# Altium schematic sheet Folio01.SchDoc
size A3; SheetNumber: 1; SheetTotal: 1
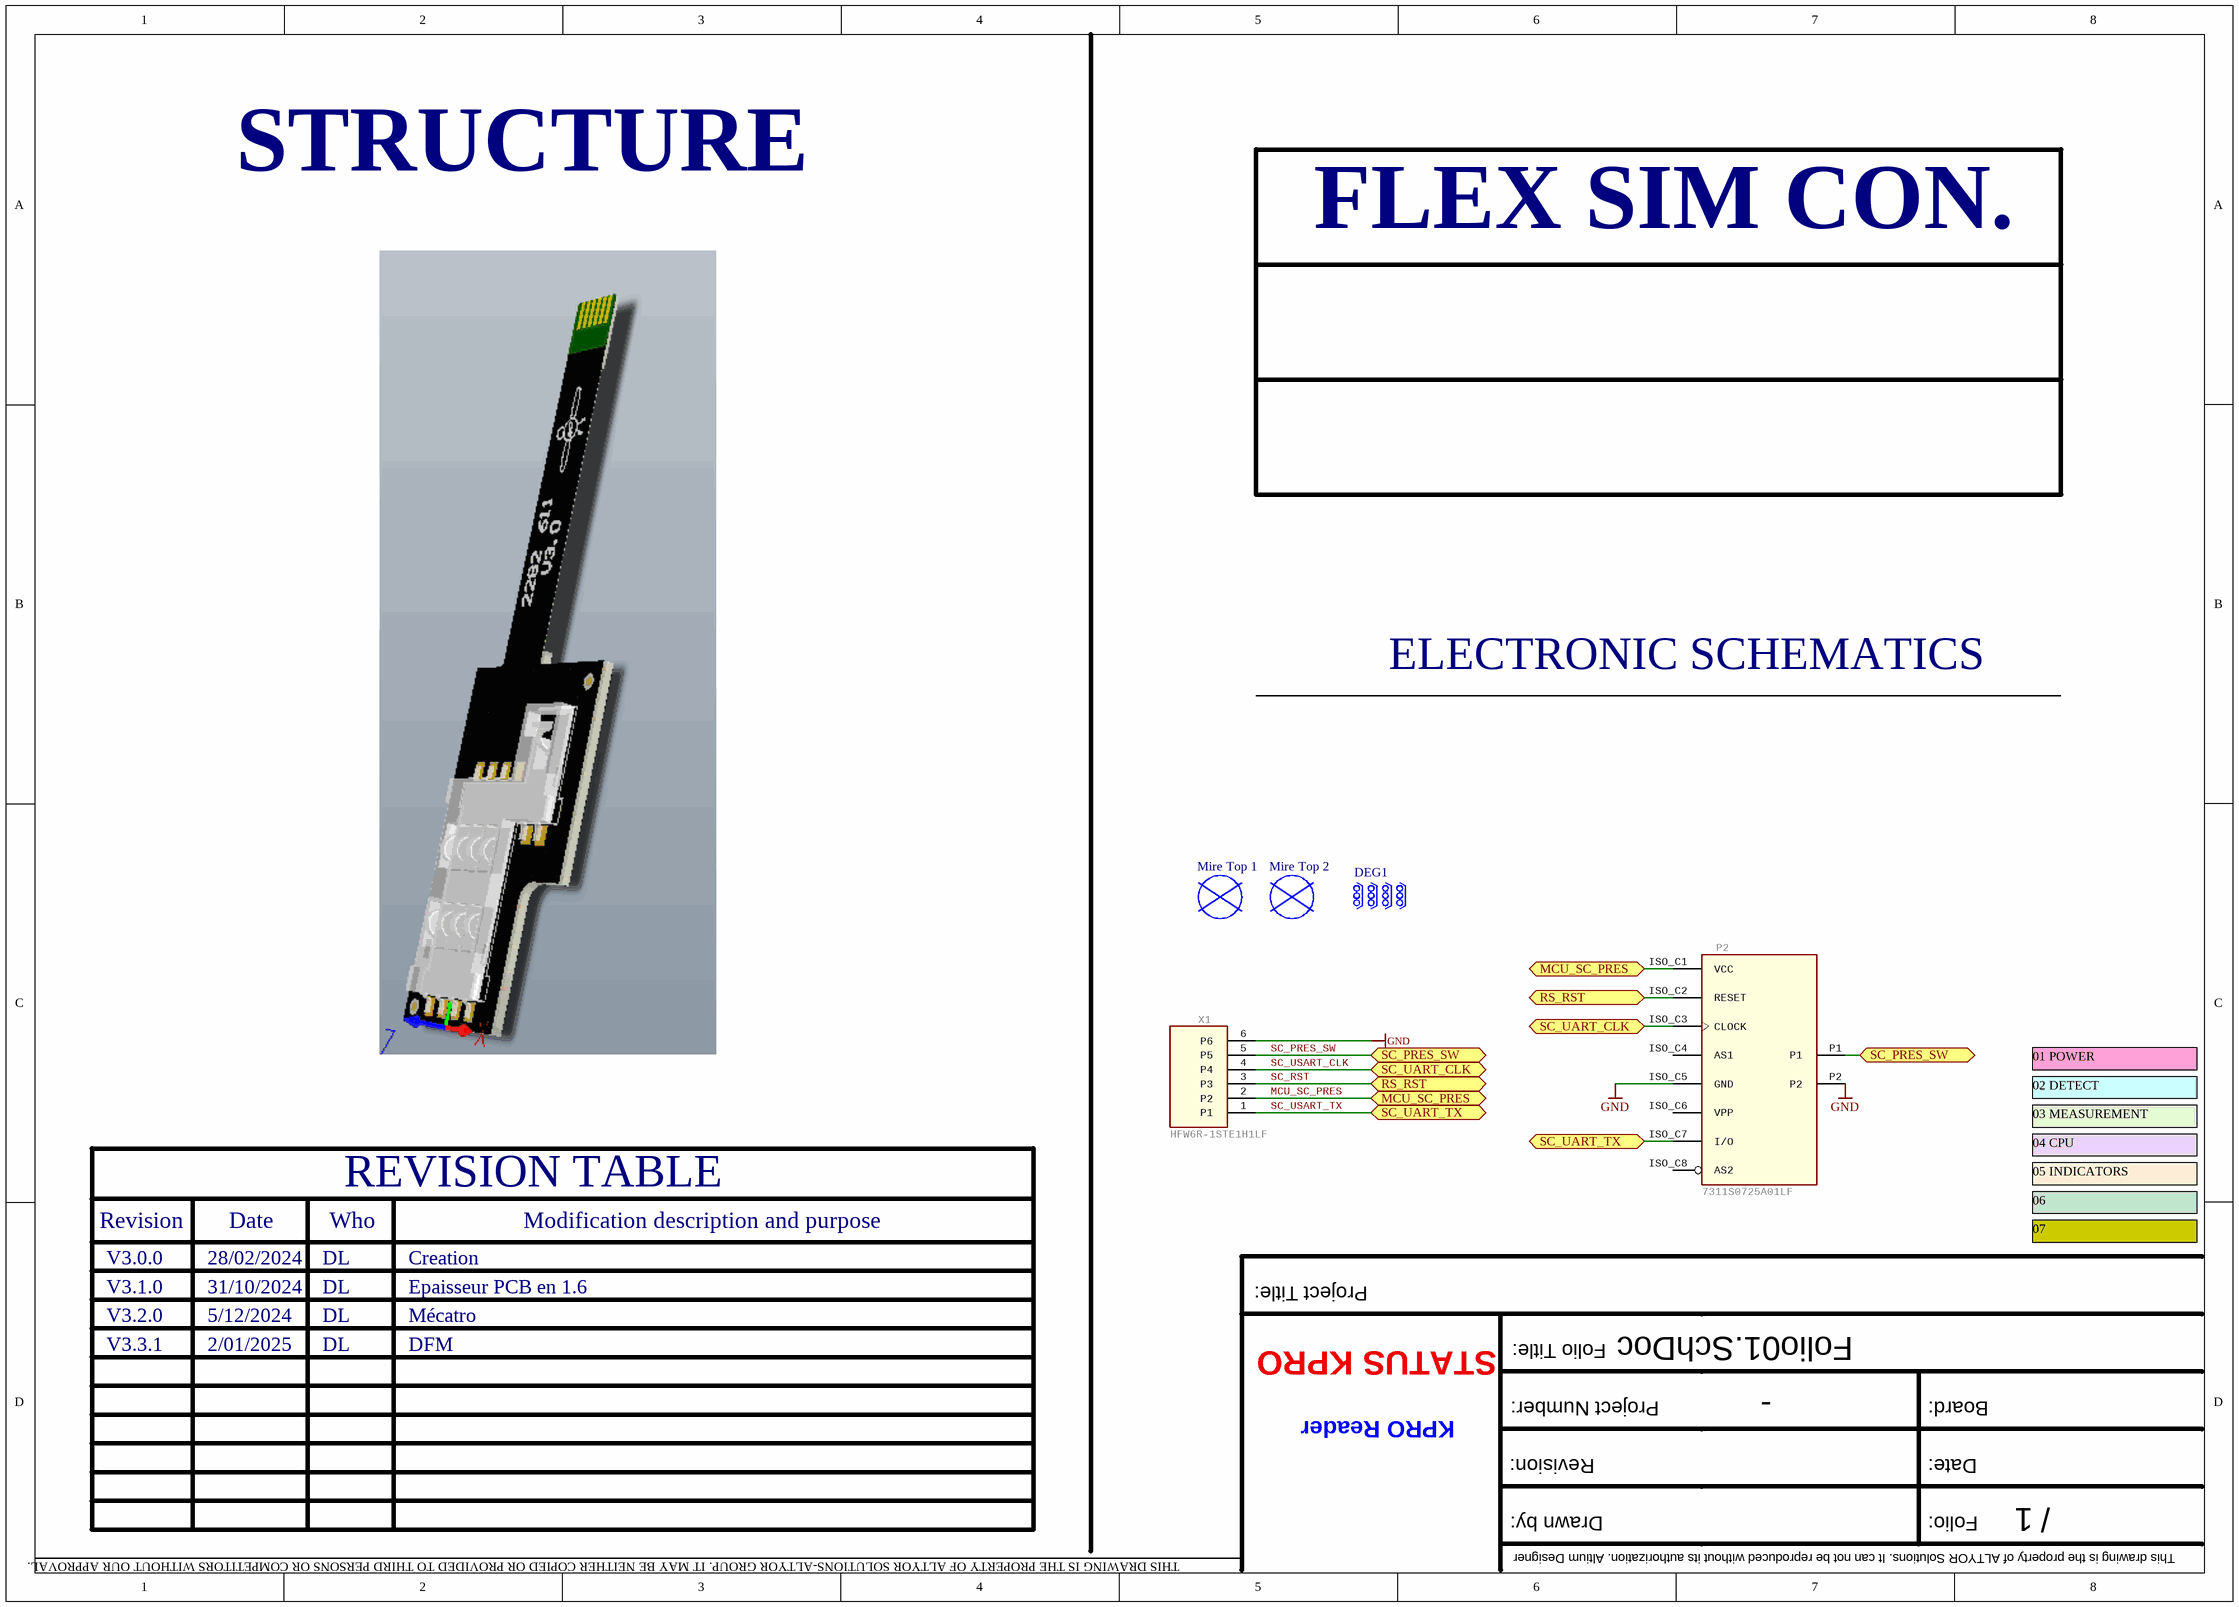
[diagram p0: Folio01.SchDoc]

## Parts
DEG1  DNI  [DEGRAPAGE 3 x 0.5]  (value not drawn)  (no BOM)
DEG2  DNI  [DEGRAPAGE 3 x 0.5]  (value not drawn)  (no BOM)
DEG3  DNI  [DEGRAPAGE 3 x 0.5]  (value not drawn)  (no BOM)
DEG4  DNI  [DEGRAPAGE 3 x 0.5]  (value not drawn)  (no BOM)
Mire_Top_1  DNI  [MIRE]  (value not drawn)
Mire_Top_2  DNI  [MIRE]  (value not drawn)
P2  7311S0725A01LF  [7311S0725A01LF]
X1  HFW6R-1STE1H1LF  [FPC_HFW6R-1STE1H1LF]  (no BOM)

## Ports
MCU_SC_PRES, RS_RST, SC_PRES_SW, SC_UART_CLK, SC_UART_TX

## Nets
GND: P2.ISO_C5(GND) P2.P2 X1.6(P6)
MCU_SC_PRES: P2.ISO_C1(VCC) X1.2(P2) ; port MCU_SC_PRES
SC_PRES_SW: P2.P1 X1.5(P5) ; port SC_PRES_SW
SC_RST: P2.ISO_C2(RESET) X1.3(P3) ; port RS_RST
SC_USART_CLK: P2.ISO_C3(CLOCK) X1.4(P4) ; port SC_UART_CLK
SC_USART_TX: P2.ISO_C7(I/O) X1.1(P1) ; port SC_UART_TX

Not connected (* = marked no-connect by the designer): P2 ISO_C4(AS1) ISO_C6(VPP) ISO_C8(AS2)

## Notes on the sheet
- STRUCTURE
- FLEX SIM CON.
- ELECTRONIC SCHEMATICS
- 02 DETECT
- 01 POWER
- 03 MEASUREMENT
- REVISION TABLE
- 04 CPU
- 05 INDICATORS
- Revision
- V3.0.0
- 28/02/2024
- Date
- DL
- Who
- Creation
- Modification description and purpose
- 06
- 07
- V3.1.0
- V3.2.0
- 31/10/2024
- 5/12/2024
- Epaisseur PCB en 1.6
- Mécatro
- V3.3.1
- 2/01/2025
- DFM
- STATUS KPRO
- Project Title:
- Folio Title:
- KPRO Reader
- Project Number:
- -
- Board:
- Revision:
- Date:
- THIS DRAWING IS THE PROPERTY OF ALTYOR SOLUTIONS-ALTYOR GROUP. IT MAY BE NEITHER COPIED OR PROVIDED TO THIRD PERSONS OR COMPETITORS WITHOUT OUR APPROVAL.
- Drawn by:
- Folio:
- /
- This drawing is the property of ALTYOR Solutions. It can not be reproduced without its authorization. Altium Designer

## Library data of the parts
DEG1-DEG4 = DEGRAP_3: Dégrapage (Breakout Tab); LIBRARY REFERENCE: DEGRAP; ERP CODE: 10-*; ERP SF CODE: 16; GENERIC: False; TMAX: N/A; TMIN: N/A; NAME: DEGRAP
Mire_Top_1 Mire_Top_2 = Mire: NAME: DNI
P2 = 7311S0725A01LF: 8 Positions connecteur de carte Micro SIM Montage en surface Ã  angle droit Or avec commutateur; MANUFACTURER: AMPHENOL; TMAX: 85; ARTICLE CODE: MSR 649-7311S0725A01LF; GENERIC: False; TMIN: -40; NAME: 8P READER; ERP CODE: 10-*
X1 = FPC_HFW6R-1STE1H1LF: Connecteur FCC 6pts 1mm - bottom contect- right angle - 6x1mm; MANUFACTURER: AMPHENOL; TMAX: 105; ARTICLE CODE: MSR 649-HFW6R-1STE1H1LF; TMIN: -55; NAME: FCC 6x1mm; GENERIC: à tester (status im)